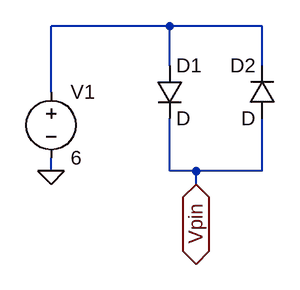
[diagram p0: schematic Draft7.asc]
Draft7.asc, the LTspice schematic file:
Version 4
SHEET 1 880 680
WIRE 32 48 -112 48
WIRE 144 48 32 48
WIRE 32 96 32 48
WIRE 144 96 144 48
WIRE -112 128 -112 48
WIRE -112 224 -112 208
WIRE 32 224 32 160
WIRE 64 224 32 224
WIRE 144 224 64 224
WIRE 144 224 144 160
WIRE 64 240 64 224
FLAG -112 224 0
FLAG 64 240 Vpin
IOPIN 64 240 BiDir
SYMBOL diode 16 96 R0
SYMATTR InstName D1
SYMBOL diode 160 160 R180
WINDOW 0 24 64 Left 2
WINDOW 3 24 0 Left 2
SYMATTR InstName D2
SYMBOL voltage -112 112 R0
WINDOW 123 0 0 Left 0
WINDOW 39 0 0 Left 0
SYMATTR InstName V1
SYMATTR Value 6

The netlist it stands for:
* Draft7.asc
D1 N001 Vpin D
D2 Vpin N001 D
V1 N001 0 6
.model D D
.lib standard.dio
.backanno
.end